# Altium schematic sheet Sheet_1_2021-08-17.schdoc
size 277 x 201 mm
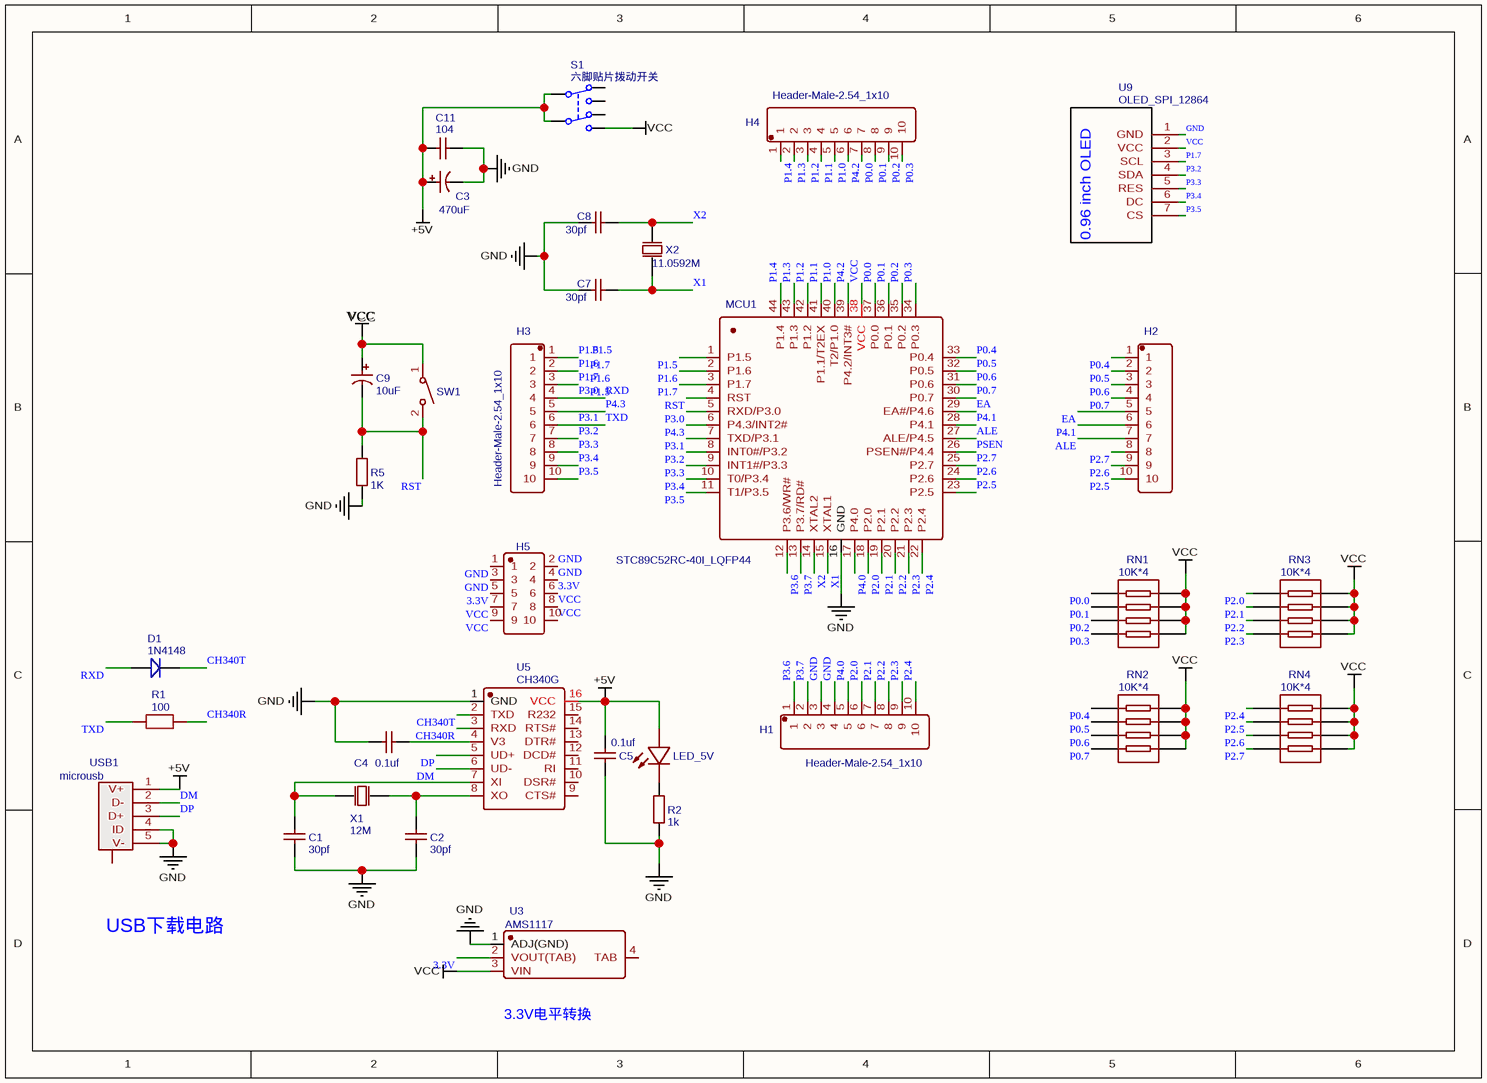
[diagram p0: Sheet_1_2021-08-17.schdoc]

## Parts
C1  30pf  [CAP0603]
C2  30pf  [CAP0603]
C3  470uF  [CAP-T3216-A]
C4  0.1uf  [CAP0603]
C5  0.1uf  [CAP0603]
C7  30pf  [CAP0603]
C8  30pf  [CAP0603]
C9  10uF  [CAP-T3216-A]
C11  104  [CAP0603]
D1  1N4148  [D-1206]
H1  Header-Male-2.54_1x10  [HDR-TH_10P-P2.54-V]
H2  Header-Male-2.54_1x10  [HDR-TH_10P-P2.54-V]  (value not drawn)
H3  Header-Male-2.54_1x10  [HDR-TH_10P-P2.54-V]
H4  Header-Male-2.54_1x10  [HDR-TH_10P-P2.54-V]
H5  X6521FV-2×05-C85D32  [HDR-TH_10P-P2.54-V-F-R2-C5-S2.54]  (value not drawn)
LED_5V  led Green  [D0603-RD]  (value not drawn)
MCU1  STC89C52RC-40I_LQFP44  [LQFP-44_L10.0-W10.0-P0.80-LS12.0-BL]
R1  100  [0603]
R2  1k  [0603]
R5  1K  [0603]
RN1  10K*4  [0603_X4]
RN2  10K*4  [0603_X4]
RN3  10K*4  [0603_X4]
RN4  10K*4  [0603_X4]
S1  六脚贴片拨动开关  [MSS-22C02]
SW1  UK-B0240-W-250-JZ  [龟仔微动]  (value not drawn)
U3  AMS1117  [SOT-223_L6.7-W3.5-P2.30-BR]
U5  CH340G  [SOIC-16_L9.9-W3.9-P1.27-LS6.0-BR]
U9  OLED_SPI_12864  [2.54-7P]
USB1  microusb  [MICRO-USB-SMD_5P-P0.65-H-F_C10418]
X1  12M  [HC-49-SMD_L12.0-W4.8]
X2  11.0592M  [HC-49US_L11.5-W4.5-P4.88]

## Nets
+5V: C3.1 C5.2 C11.2 LED_5V.2(+) S1.2(COMMON1) U5.16(VCC) USB1.1(V+)
GND: C1.1 C2.2 C3.2 C4.2 C5.1 C7.1 C8.1 C11.1 H1.3 H1.4 H5.1 H5.2 H5.3 H5.4 MCU1.16(GND) R2.1 R5.1 U3.1(ADJ(GND)) U5.1(GND) U9.1(GND) USB1.4(ID) USB1.5(V-)
VCC: C9.1 H5.7 H5.8 H5.9 H5.10 MCU1.38(VCC) RN1.5 RN1.6 RN1.7 RN1.8 RN2.5 RN2.6 RN2.7 RN2.8 RN3.5 RN3.6 RN3.7 RN3.8 RN4.5 RN4.6 RN4.7 RN4.8 S1.3(NO1) SW1.1 U3.3(VIN) U9.2(VCC)
3.3V: H5.5 H5.6 U3.2(VOUT(TAB))
ALE: H2.7 MCU1.27(ALE/P4.5)
CH340R: R1.2 U5.3(RXD)
CH340T: D1.2 U5.2(TXD)
DM: U5.6(UD-) USB1.2(D-)
DP: U5.5(UD+) USB1.3(D+)
EA: H2.5 MCU1.29(EA#/P4.6)
P0.0: H4.7 MCU1.37(P0.0) RN1.4
P0.1: H4.8 MCU1.36(P0.1) RN1.3
P0.2: H4.9 MCU1.35(P0.2) RN1.2
P0.3: H4.10 MCU1.34(P0.3) RN1.1
P0.4: H2.1 MCU1.33(P0.4) RN2.4
P0.5: H2.2 MCU1.32(P0.5) RN2.3
P0.6: H2.3 MCU1.31(P0.6) RN2.2
P0.7: H2.4 MCU1.30(P0.7) RN2.1
P1.0: H4.5 MCU1.40(T2/P1.0)
P1.1: H4.4 MCU1.41(P1.1/T2EX)
P1.2: H4.3 MCU1.42(P1.2)
P1.3: H4.2 MCU1.43(P1.3)
P1.4: H4.1 MCU1.44(P1.4)
P1.5: H3.1 MCU1.1(P1.5)
P1.6: H3.2 MCU1.2(P1.6)
P1.7: H3.3 MCU1.3(P1.7) U9.3(SCL)
P2.0: H1.6 MCU1.18(P2.0) RN3.4
P2.1: H1.7 MCU1.19(P2.1) RN3.3
P2.2: H1.8 MCU1.20(P2.2) RN3.2
P2.3: H1.9 MCU1.21(P2.3) RN3.1
P2.4: H1.10 MCU1.22(P2.4) RN4.4
P2.5: H2.10 MCU1.23(P2.5) RN4.3
P2.6: H2.9 MCU1.24(P2.6) RN4.2
P2.7: H2.8 MCU1.25(P2.7) RN4.1
P3.0: D1.1 H3.4 MCU1.5(RXD/P3.0)  [also labelled RXD]
P3.1: H3.6 MCU1.7(TXD/P3.1) R1.1  [also labelled TXD]
P3.2: H3.7 MCU1.8(INT0#/P3.2) U9.4(SDA)
P3.3: H3.8 MCU1.9(INT1#/P3.3) U9.5(RES)
P3.4: H3.9 MCU1.10(T0/P3.4) U9.6(DC)
P3.5: H3.10 MCU1.11(T1/P3.5) U9.7(CS)
P3.6: H1.1 MCU1.12(P3.6/WR#)
P3.7: H1.2 MCU1.13(P3.7/RD#)
P4.0: H1.5 MCU1.17(P4.0)
P4.1: H2.6 MCU1.28(P4.1)
P4.2: H4.6 MCU1.39(P4.2/INT3#)
P4.3: H3.5 MCU1.6(P4.3/INT2#)
PSEN: MCU1.26(PSEN#/P4.4)
RST: C9.2 MCU1.4(RST) R5.2 SW1.2
X1: C7.2 MCU1.15(XTAL1) X2.1(OSC1)
X2: C8.2 MCU1.14(XTAL2) X2.2(OSC2)
NetC1_2: C1.2 U5.7(XI) X1.1(OSC1)
NetC2_1: C2.1 U5.8(XO) X1.2(OSC2)
NetC4_1: C4.1 U5.4(V3)
NetLED_5V_1: LED_5V.1(-) R2.2

Not connected (* = marked no-connect by the designer): S1 1(NC1); U3 4(TAB); U5 9(CTS#) 10(DSR#) 11(RI) 12(DCD#) 13(DTR#) 14(RTS#) 15(R232); USB1 0(MTN)

## Notes on the sheet
- (near C9) VCC
- USB下载电路
- (near U3) 3.3V电平转换
- Labels drawn without touching a wire or pin: P1.5, P1.6, P1.7
- (in symbol OLED_SPI_12864) 0.96 inch OLED

## Library data of the parts
C1 C2 C7 C8 = 30pf: BOM_Manufacturer: Guangdong Fenghua Advanced Tech; BOM_Manufacturer Part: CC81-M6S2L1B101KSE; nameAlias: Capacitance; Contributor: LCSC; BOM_Supplier: LCSC; BOM_Supplier Part: C305730; spicePre: C; spiceSymbolName: CC81-M6S2L1B101KSE
C3 = 470uF: BOM_Manufacturer: LELON; BOM_Manufacturer Part: VEJ471M1CTR-0810; nameAlias: Capacitance; Contributor: LCSC; SMT Type: Extend; BOM_Supplier: LCSC; BOM_Supplier Part: C176671; BOM_LCSC Assembly: Yes; spicePre: C; spiceSymbolName: VEJ471M1CTR-0810
C4 C5 = 0.1uf: BOM_Manufacturer: Guangdong Fenghua Advanced Tech; BOM_Manufacturer Part: CC81-M6S2L1B101KSE; nameAlias: Capacitance; Contributor: LCSC; BOM_Supplier: LCSC; BOM_Supplier Part: C305730; spicePre: C; spiceSymbolName: CC81-M6S2L1B101KSE
C9 = 10uF: BOM_Manufacturer: LELON; BOM_Manufacturer Part: VE-100M1ETR-0405; nameAlias: Capacitance; Contributor: LCSC; SMT Type: Extend; BOM_Supplier: LCSC; BOM_Supplier Part: C134721; BOM_LCSC Assembly: Yes; spicePre: C; spiceSymbolName: VE-100M1ETR-0405
C11 = 104: BOM_Manufacturer: Guangdong Fenghua Advanced Tech; BOM_Manufacturer Part: CC81-M6S2L1B101KSE; nameAlias: Capacitance; Contributor: LCSC; BOM_Supplier: LCSC; BOM_Supplier Part: C305730; spicePre: C; spiceSymbolName: CC81-M6S2L1B101KSE
D1 = 1N4148: Contributor: NJDZ; spicePre: D; spiceSymbolName: 1N4148
H1-H4 = Header-Male-2.54_1x10: BOM_Manufacturer Part: Headers  Pins2.54mm1*10P; BOM_Supplier: LCSC; image: http://image.lceda.cn/szlcsc/C57369.jpg; BOM_Supplier Part: C57369; spicePre: H; spiceSymbolName: Header-Male-2.54_1x10
H5 = X6521FV-2×05-C85D32: BOM_Manufacturer: XKB Connectivity; Contributor: LCSC; BOM_Supplier: LCSC; BOM_Supplier Part: C718231; BOM_Manufacturer Part: X6521FV-2×05-C85D32; spicePre: H; spiceSymbolName: X6521FV-2×05-C85D32
LED_5V = led Green: BOM_Manufacturer: KENTO; SMT Type: Extend; BOM_Supplier: LCSC; BOM_Manufacturer Part: led Green; image: //image.lceda.cn/szlcsc/C14641.jpg; BOM_Supplier Part: C14641; BOM_LCSC Assembly: Yes; spicePre: L; spiceSymbolName: led Green
MCU1 = STC89C52RC-40I_LQFP44: BOM_Manufacturer: STC; SMT Type: Basic; Package Display: No; BOM_Supplier: LCSC; BOM_Manufacturer Part: STC89C52RC-40I; BOM_LCSC Assembly: Yes; BOM_Supplier Part: C8707; spicePre: U; spiceSymbolName: STC89C52RC-40I_C8707
R1 = 100: nameAlias: Value(Ω); Contributor: LCEDA_Lib; spicePre: R; spiceSymbolName: R_0603_EU
R2 = 1k: BOM_Manufacturer Part: 0603WAF1000T5E; nameAlias: Value; BOM_Supplier: LCSC; BOM_LCSC Assembly: Yes; BOM_Supplier Part: C22775; spicePre: R; spiceSymbolName: 0603
R5 = 1K: BOM_Manufacturer Part: 0603WAF1000T5E; nameAlias: Value; BOM_Supplier: LCSC; BOM_LCSC Assembly: Yes; BOM_Supplier Part: C22775; spicePre: R; spiceSymbolName: 0603
RN1-RN4 = 10K*4: BOM_Manufacturer: FH; BOM_Manufacturer Part: RC-ML08W103JT; nameAlias: Resistance (Ohms); Contributor: amwhibo; BOM_公司编号: 12070002; BOM_Supplier: LCSC; BOM_Supplier Part: C69593; spicePre: R; spiceSymbolName: 0603*4-1/8W-10K-5%-100ppm
S1 = 六脚贴片拨动开关: Contributor: yds432427; spicePre: S; spiceSymbolName: 六脚贴片拨动开关
SW1 = UK-B0240-W-250-JZ: BOM_Manufacturer: USAKRO; Contributor: LCSC; BOM_Supplier: LCSC; BOM_Supplier Part: C780530; BOM_Manufacturer Part: UK-B0240-W-250-JZ; spicePre: S; spiceSymbolName: UK-B0240-W-250-JZ
U3 = AMS1117: BOM_Manufacturer: Youtai Semiconductor Co., Ltd.; BOM_Manufacturer Part: AMS1117-5.0; Contributor: LCSC; SMT Type: Extend; BOM_Supplier: LCSC; BOM_Supplier Part: C347223; BOM_LCSC Assembly: Yes; spicePre: U; spiceSymbolName: AMS1117-5.0_C347223
U5 = CH340G: BOM_Manufacturer: WCH; SMT Type: Basic; timeStamp: 1468327462; BOM_Supplier: LCSC; BOM_Manufacturer Part: CH340G; BOM_LCSC Assembly: Yes; image: //image.lceda.cn/szlcsc/C14267.jpg; BOM_Supplier Part: C14267; spicePre: U; spiceSymbolName: CH340G
U9 = OLED_SPI_12864: BOM_Manufacturer Part: OLED I2C 12864; Contributor: qq137550162; BOM_Mounted: Yes; spicePre: U; spiceSymbolName: OLED_SPI_12864
USB1 = microusb: BOM_Manufacturer: ValuePro; BOM_Manufacturer Part: micro USBFemale; BOM_Supplier: LCSC; image: //image.lceda.cn/szlcsc/C10418.jpg; BOM_Supplier Part: C10418; spicePre: U; spiceSymbolName: micro USBFemale
X1 = 12M: BOM_Manufacturer: ZheJiang East Crystal Elec; BOM_Manufacturer Part: B08000J067; nameAlias: Frequency; Contributor: LCSC; BOM_Supplier: LCSC; BOM_Supplier Part: C280058; spicePre: X; spiceSymbolName: B08000J067
X2 = 11.0592M: BOM_Manufacturer: ZheJiang East Crystal Elec; BOM_Manufacturer Part: B08000J067; nameAlias: Frequency; Contributor: LCSC; BOM_Supplier: LCSC; BOM_Supplier Part: C280058; spicePre: X; spiceSymbolName: B08000J067